# Altium project GSM.PrjPCB
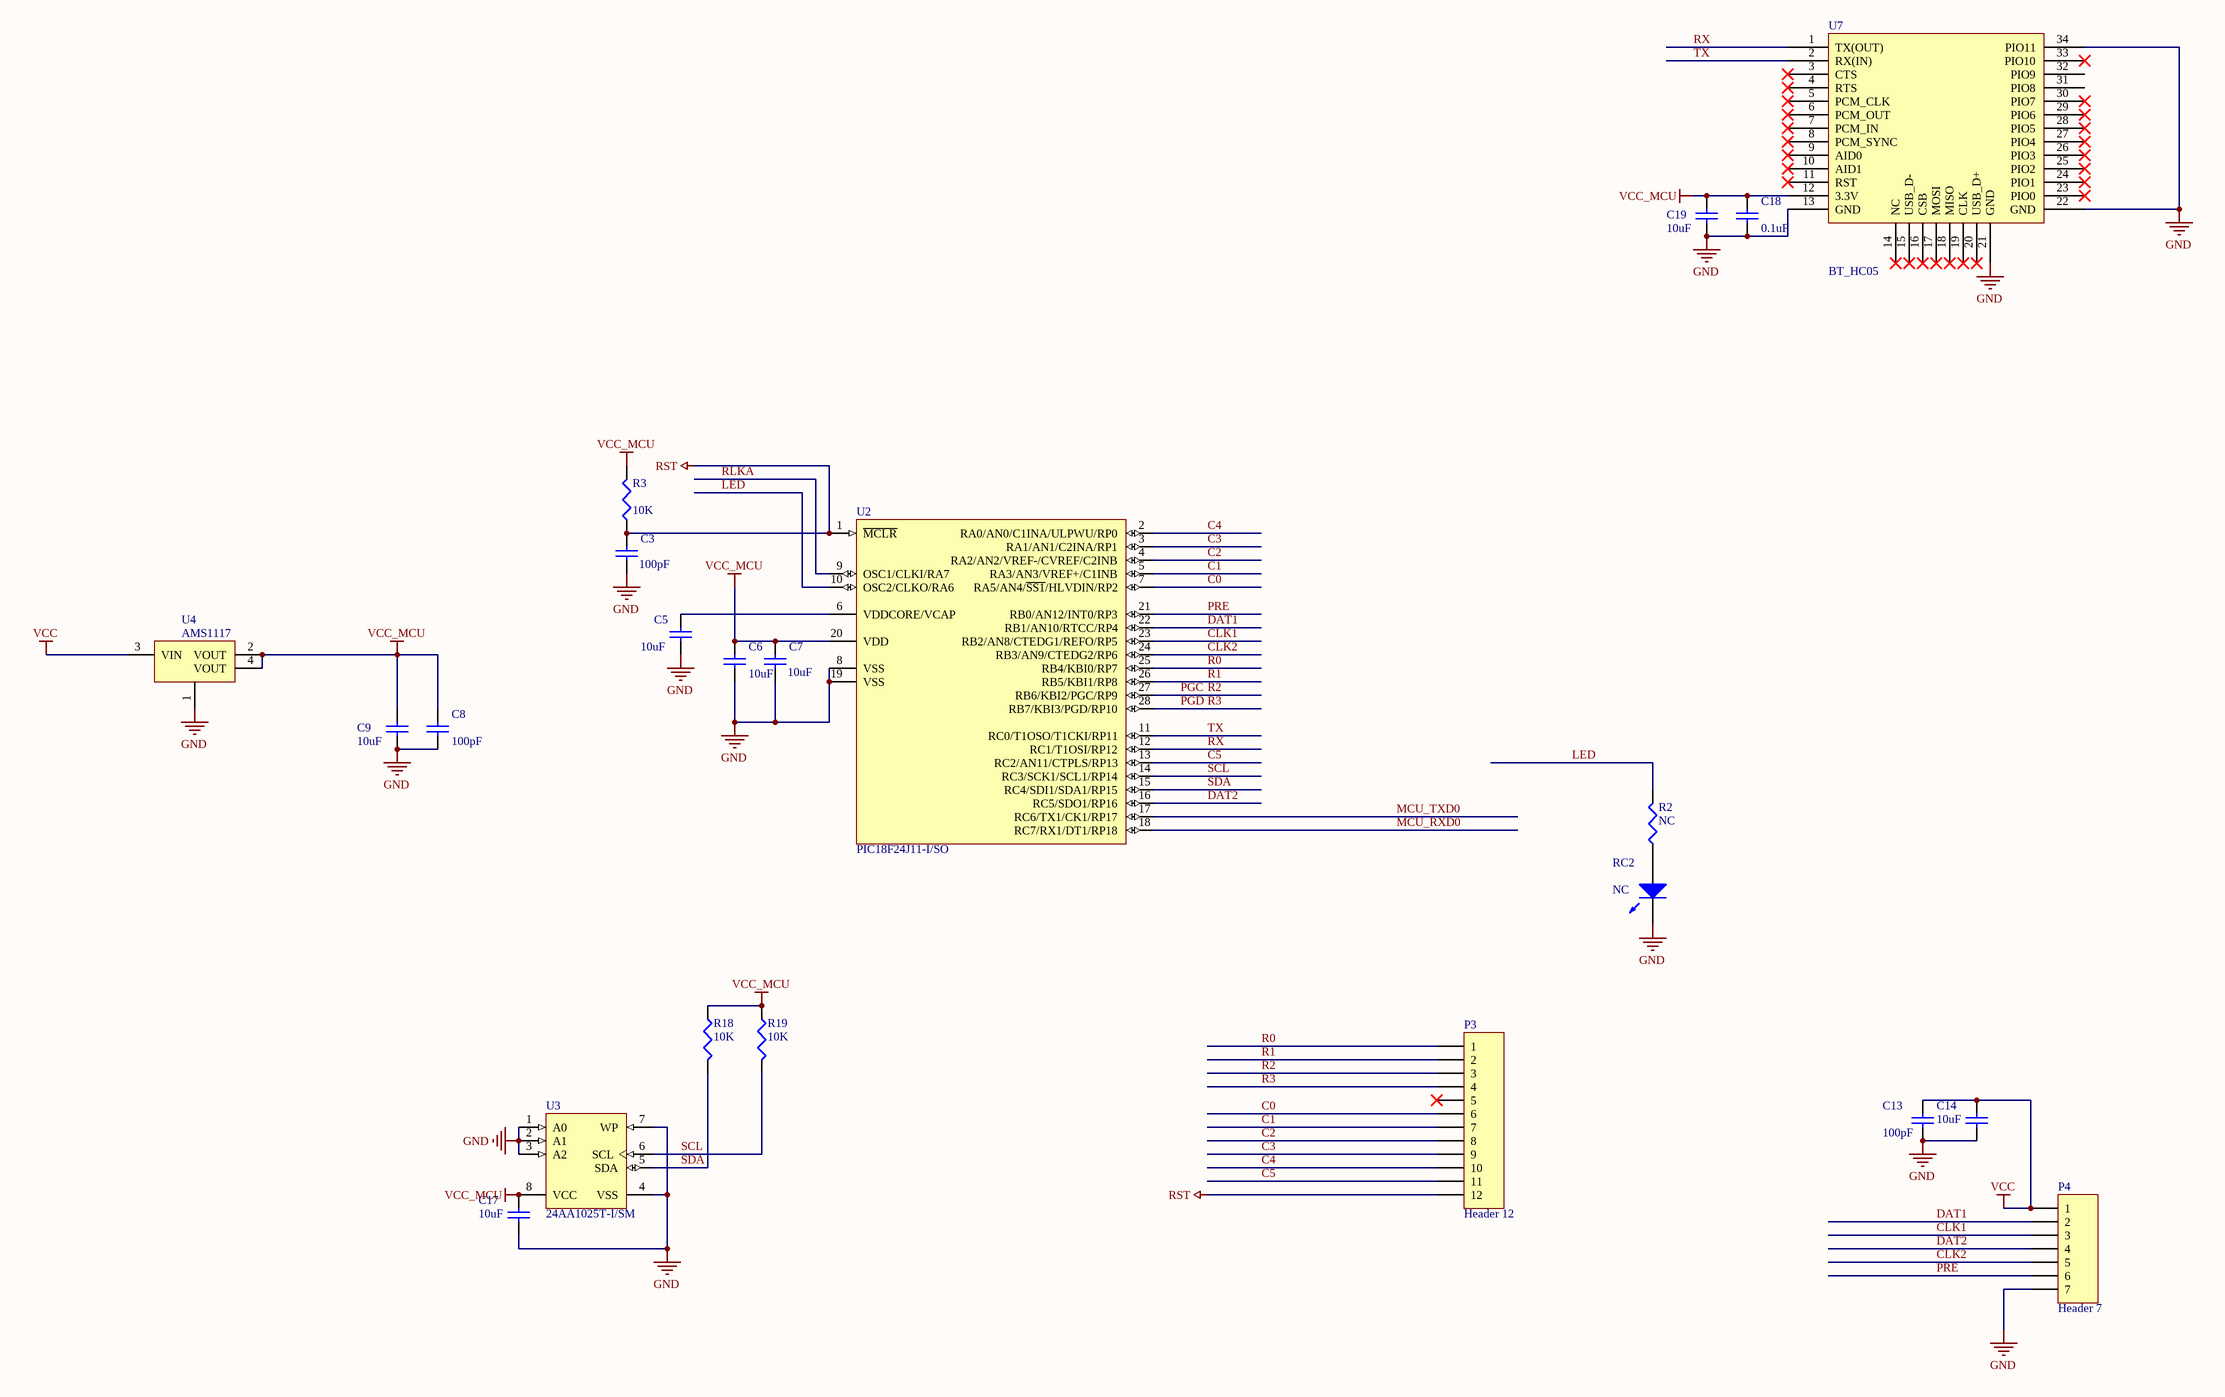
[diagram p0: Sheet1.SchDoc]
1 sheet, 22 parts. Net scope: global (net labels, ports and power ports of the same name join across sheets).
Board file: PCB1.PcbDoc

## Sheet Sheet1.SchDoc
size C

### Parts
C3  value 100pF  [CAPC2013X05N]  (hidden comment: CL21F104ZBCNNNC)
C5  value 10uF  [CAPC2013X05N]  (hidden comment: GRM219R60J106KE19D)
C6  value 10uF  [CAPC2013X05N]  (hidden comment: GRM219R60J106KE19D)
C7  value 10uF  [CAPC2013X05N]  (hidden comment: GRM219R60J106KE19D)
C8  value 100pF  [RESC2012L]  (hidden comment: CL21F104ZBCNNNC)
C9  value 10uF  [RESC2012L]  (hidden comment: GRM219R60J106KE19D)
C13  value 100pF  [RESC2012L]  (hidden comment: CL21F104ZBCNNNC)
C14  value 10uF  [RESC2012L]  (hidden comment: GRM219R60J106KE19D)
C17  value 10uF  [RESC2012L]  (hidden comment: GRM219R60J106KE19D)
C18  value 0.1uF  [RESC2012L]  (hidden comment: CL21F104ZBCNNNC)
C19  value 10uF  [RESC2012L]  (hidden comment: LMK212F106ZG-T)
P3  Header 12  [HDR1X12]
P4  Header 7  [HDR1X7]
R2  NC  [RESC2012L]
R3  value 10K  [RESC2013X05N]  (hidden comment: ERJ-6GEYJ103V)
R18  value 10K  [RESC2012L]  (hidden comment: ERJ-6GEYJ103V)
R19  value 10K  [RESC2012L]  (hidden comment: ERJ-6GEYJ103V)
RC2  NC  [CD3216-1206]
U2  PIC18F24J11-I/SO  [SOIC-SO28_N]
U3  24AA1025T-I/SM  [SOIJ-SM8_N]
U4  AMS1117  [SOT223-4M]
U7  BT_HC05  [bluetooth_HC05]

### Nets
GND: C3.1 C5.1 C6.1 C7.1 C8.2 C9.2 C13.2 C14.2 C17.2 C18.2 C19.2 P4.7 RC2.2(K) U2.8(VSS) U2.19(VSS) U3.1(A0) U3.2(A1) U3.3(A2) U3.4(VSS) U3.7(WP) U4.1(GND) U7.13(GND) U7.21(GND) U7.22(GND) U7.34(PIO11)
RST: C3.2 P3.12 R3.1 U2.1(~{MCLR})
VCC: C13.1 C14.1 P4.1 U4.3(VIN)
VCC_MCU: C6.2 C7.2 C8.1 C9.1 C17.1 C18.1 C19.1 R3.2 R18.2 R19.2 U2.20(VDD) U3.8(VCC) U4.2(VOUT) U4.4(VOUT) U7.12(3.3V)
C0: P3.6 U2.7(RA5/AN4/~{SS1}/HLVDIN/RP2)
C1: P3.7 U2.5(RA3/AN3/VREF+/C1INB)
C2: P3.8 U2.4(RA2/AN2/VREF-/CVREF/C2INB)
C3: P3.9 U2.3(RA1/AN1/C2INA/RP1)
C4: P3.10 U2.2(RA0/AN0/C1INA/ULPWU/RP0)
C5: P3.11 U2.13(RC2/AN11/CTPLS/RP13)
CLK1: P4.3 U2.23(RB2/AN8/CTEDG1/REFO/RP5)
CLK2: P4.5 U2.24(RB3/AN9/CTEDG2/RP6)
DAT1: P4.2 U2.22(RB1/AN10/RTCC/RP4)
DAT2: P4.4 U2.16(RC5/SDO1/RP16)
LED: R2.1 U2.10(OSC2/CLKO/RA6)
MCU_RXD0: U2.18(RC7/RX1/DT1/RP18)
MCU_TXD0: U2.17(RC6/TX1/CK1/RP17)
PGC: P3.3 U2.27(RB6/KBI2/PGC/RP9)  [also labelled R2]
PGD: P3.4 U2.28(RB7/KBI3/PGD/RP10)  [also labelled R3]
PRE: P4.6 U2.21(RB0/AN12/INT0/RP3)
R0: P3.1 U2.25(RB4/KBI0/RP7)
R1: P3.2 U2.26(RB5/KBI1/RP8)
RLKA: U2.9(OSC1/CLKI/RA7)
RX: U2.12(RC1/T1OSI/RP12) U7.1(TX(OUT))
SCL: R19.1 U2.14(RC3/SCK1/SCL1/RP14) U3.6(SCL)
SDA: R18.1 U2.15(RC4/SDI1/SDA1/RP15) U3.5(SDA)
TX: U2.11(RC0/T1OSO/T1CKI/RP11) U7.2(RX(IN))
NetC5_2: C5.2 U2.6(VDDCORE/VCAP)
NetR2_2: R2.2 RC2.1(A)

Not connected (* = marked no-connect by the designer): P3 5*; U7 3(CTS)* 4(RTS)* 5(PCM_CLK)* 6(PCM_OUT)* 7(PCM_IN)* 8(PCM_SYNC)* 9(AID0)* 10(AID1)* 11(RST)* 14(NC)* 15(USB_D-)* 16(CSB)* 17(MOSI)* 18(MISO)* 19(CLK)* 20(USB_D+)* 23(PIO0)* 24(PIO1)* 25(PIO2)* 26(PIO3)* 27(PIO4)* 28(PIO5)* 29(PIO6)* 30(PIO7)* 31(PIO8) 32(PIO9) 33(PIO10)*

### Library data of the parts
C3 = Cap Semi: 0.10µF 50V Ceramic Capacitor Y5V (F) 0805 (2012 Metric) 0.079" L x 0.049" W (2.00mm x 1.25mm)
C5 C6 = Cap Semi: 10µF 6.3V Ceramic Capacitor X5R 0805 (2012 Metric) 0.079" L x 0.049" W (2.00mm x 1.25mm)
C7 = Cap Semi: 0.10µF 50V Cera2012 Metric) 0.079" L x 0.049" W (2.00mm x 1.25mm)
C8 C13 = Cap: 0.10µF 50V Ceramic Capacitor Y5V (F) 0805 (2012 Metric) 0.079" L x 0.049" W (2.00mm x 1.25mm)
C9 C14 C17 = Cap: 10µF 6.3V Ceramic Capacitor X5R 0805 (2012 Metric) 0.079" L x 0.049" W (2.00mm x 1.25mm)
C18 = Cap: CAP CER 0.1UF 50V Y5V 0805; Published: 8-Jun-2000; LatestRevisionDate: 17-Jul-2002; LatestRevisionNote: Re-released for DXP Platform.; PackageReference: RAD-0.3; Publisher: Altium Limited; PackageDescription: Radial Cap, Thru-Hole; 2 Leads; 0.3 in Pin Spacing
C19 = Cap: CAP CER 10UF 10V Y5V 0805; Published: 8-Jun-2000; LatestRevisionDate: 17-Jul-2002; LatestRevisionNote: Re-released for DXP Platform.; PackageReference: RAD-0.3; Publisher: Altium Limited; PackageDescription: Radial Cap, Thru-Hole; 2 Leads; 0.3 in Pin Spacing
P3 = Header 12: Header, 12-Pin; LatestRevisionDate: 17-Jul-2002; LatestRevisionNote: Re-released for DXP Platform.; Publisher: Altium Limited
P4 = Header 7: Header, 7-Pin; LatestRevisionDate: 17-Jul-2002; LatestRevisionNote: Re-released for DXP Platform.; Publisher: Altium Limited
R2 = Res3: Published: 8-Jun-2000; LatestRevisionDate: 29-May-2009; LatestRevisionNote: IPC-7351 Footprint Added.; PackageReference: J1-0603; Publisher: Altium Limited; PackageDescription: Chip Resistor; Value: NC
R3 R18 R19 = Res3: RES SMD 10K OHM 5% 1/8W 0805
RC2 = LEDRED1206: LED BLUE THRU BOARD 1206; VENDOR P/N: LH N974-KN-1; VENDOR: OSRAM Opto Semiconductors Inc; Indicate: 12V; GGC VENDOR: OSRAM Opto Semiconductors Inc; GCC P/N: LH N974-KN-1; DIGIKEY P/N: P0.0JCT-ND; DIGIKEY MOQ1: 0.11
U2 = PIC18F24J11-I/SO: Low Power, High Performance Microcontroller with nanoWatt XLP Technology, 28-pin SOIC, Industrial Temperature; Published: 2-Dec-2009; DatasheetVersion: revC, Oct-2009; PackageVersion: revBB, Aug-2009; PackageReference: SOIC-SO28; Publisher: Altium Limited; PackageDescription: 28-Lead Plastic Small Outline (SO) - Wide 7.50mm Body [SOIC]; Supplier 1: Digi-Key; Supplier Part Number 1: PIC18F24J11-I/SO-ND; Supplier 2: Farnell; Supplier Part Number 2: 1706302; Code_JEDEC: MS-013; ComponentLink1Description: Datasheet; ComponentLink1URL: http://ww1.microchip.com/downloads/en/DeviceDoc/39932c.pdf; ComponentLink2Description: Packaging Specification; ComponentLink2URL: http://www.microchip.com/stellent/groups/techpub_sg/documents/packagingspec/en012702.pdf; ComponentLink3Description: Microchip.com Home; ComponentLink3URL: http://www.microchip.com/
U3 = 24AA1025T-I/SM: 1 Mbit, 400kHz, 1.7V, I2C Serial EEPROM, 8-Pin SOIC 208mil, Industrial Temperature, Tape and Reel; Published: 29-Jan-2009; DatasheetVersion: revF, Oct-2008; PackageVersion: revBB, Aug-2009; PackageReference: SOIJ-SM8; Publisher: Altium Limited; PackageDescription: 8-Lead Plastic Small Outline (SM) - Medium, 5.28 mm Body [SOIJ]; Supplier 1: Digi-Key; Supplier Part Number 1: 24AA1025T-I/SM-ND; ComponentLink1Description: Datasheet; ComponentLink1URL: http://ww1.microchip.com/downloads/en/DeviceDoc/21941F.pdf; ComponentLink2Description: Packaging Specification; ComponentLink2URL: http://www.microchip.com/stellent/groups/techpub_sg/documents/packagingspec/en012702.pdf; ComponentLink3Description: Microchip.com Home; ComponentLink3URL: http://www.microchip.com/
U4 = AMS1117: Adjustable Precision Shunt Regulator; Published: 15-Apr-2002; DatasheetVersion: Oct-2000; PackageVersion: Oct-1994; PackageReference: PK03; Publisher: Altium Limited; PackageDescription: SOT-89; Body 4.6 x 4.25 mm, inc. leads (LxW max); Code_JEDEC: TO-243-AA; Code_IPC: SOT 89; ComponentLink1Description: Manufacturer Link; ComponentLink1URL: http://www.ti.com/; ComponentLink2Description: Datasheet; ComponentLink2URL: http://www-s.ti.com/sc/ds/tl431a.pdf